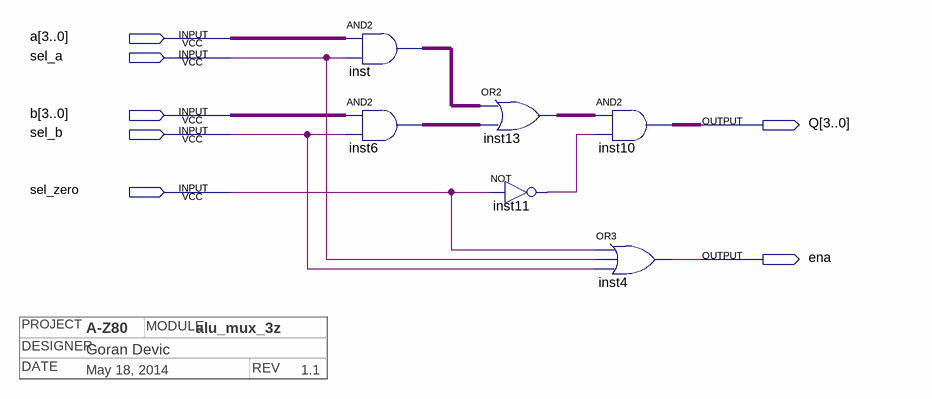
[diagram p0: schematic sheet]
// Quartus schematic alu_mux_3z.bdf as structural Verilog: 6 symbols, 7 pins
// Title block: PROJECT: A-Z80; MODULE: alu_mux_3z; DESIGNER: Goran Devic; DATE: May 18, 2014; REV: 1.1
module alu_mux_3z (
  input  [3:0] a,
  input  sel_a,
  input  [3:0] b,
  input  sel_b,
  input  sel_zero,
  output [3:0] Q,
  output ena
);

  wire inst11_out;
  wire [3:0] inst6_out, inst13_out, inst_out;

  assign inst_out = a & {4{sel_a}};  // AND2 inst, 4 bits wide
  assign inst6_out = b & {4{sel_b}};  // AND2 inst6, 4 bits wide
  assign inst13_out = inst_out | inst6_out;  // OR2 inst13, 4 bits wide
  not inst11 (inst11_out, sel_zero);
  assign Q = inst13_out & {4{inst11_out}};  // AND2 inst10, 4 bits wide
  or inst4 (ena, sel_zero, sel_a, sel_b);
endmodule
